# Altium project LimeSDR-X3_1v0.PrjPcb (part 19 of 19)
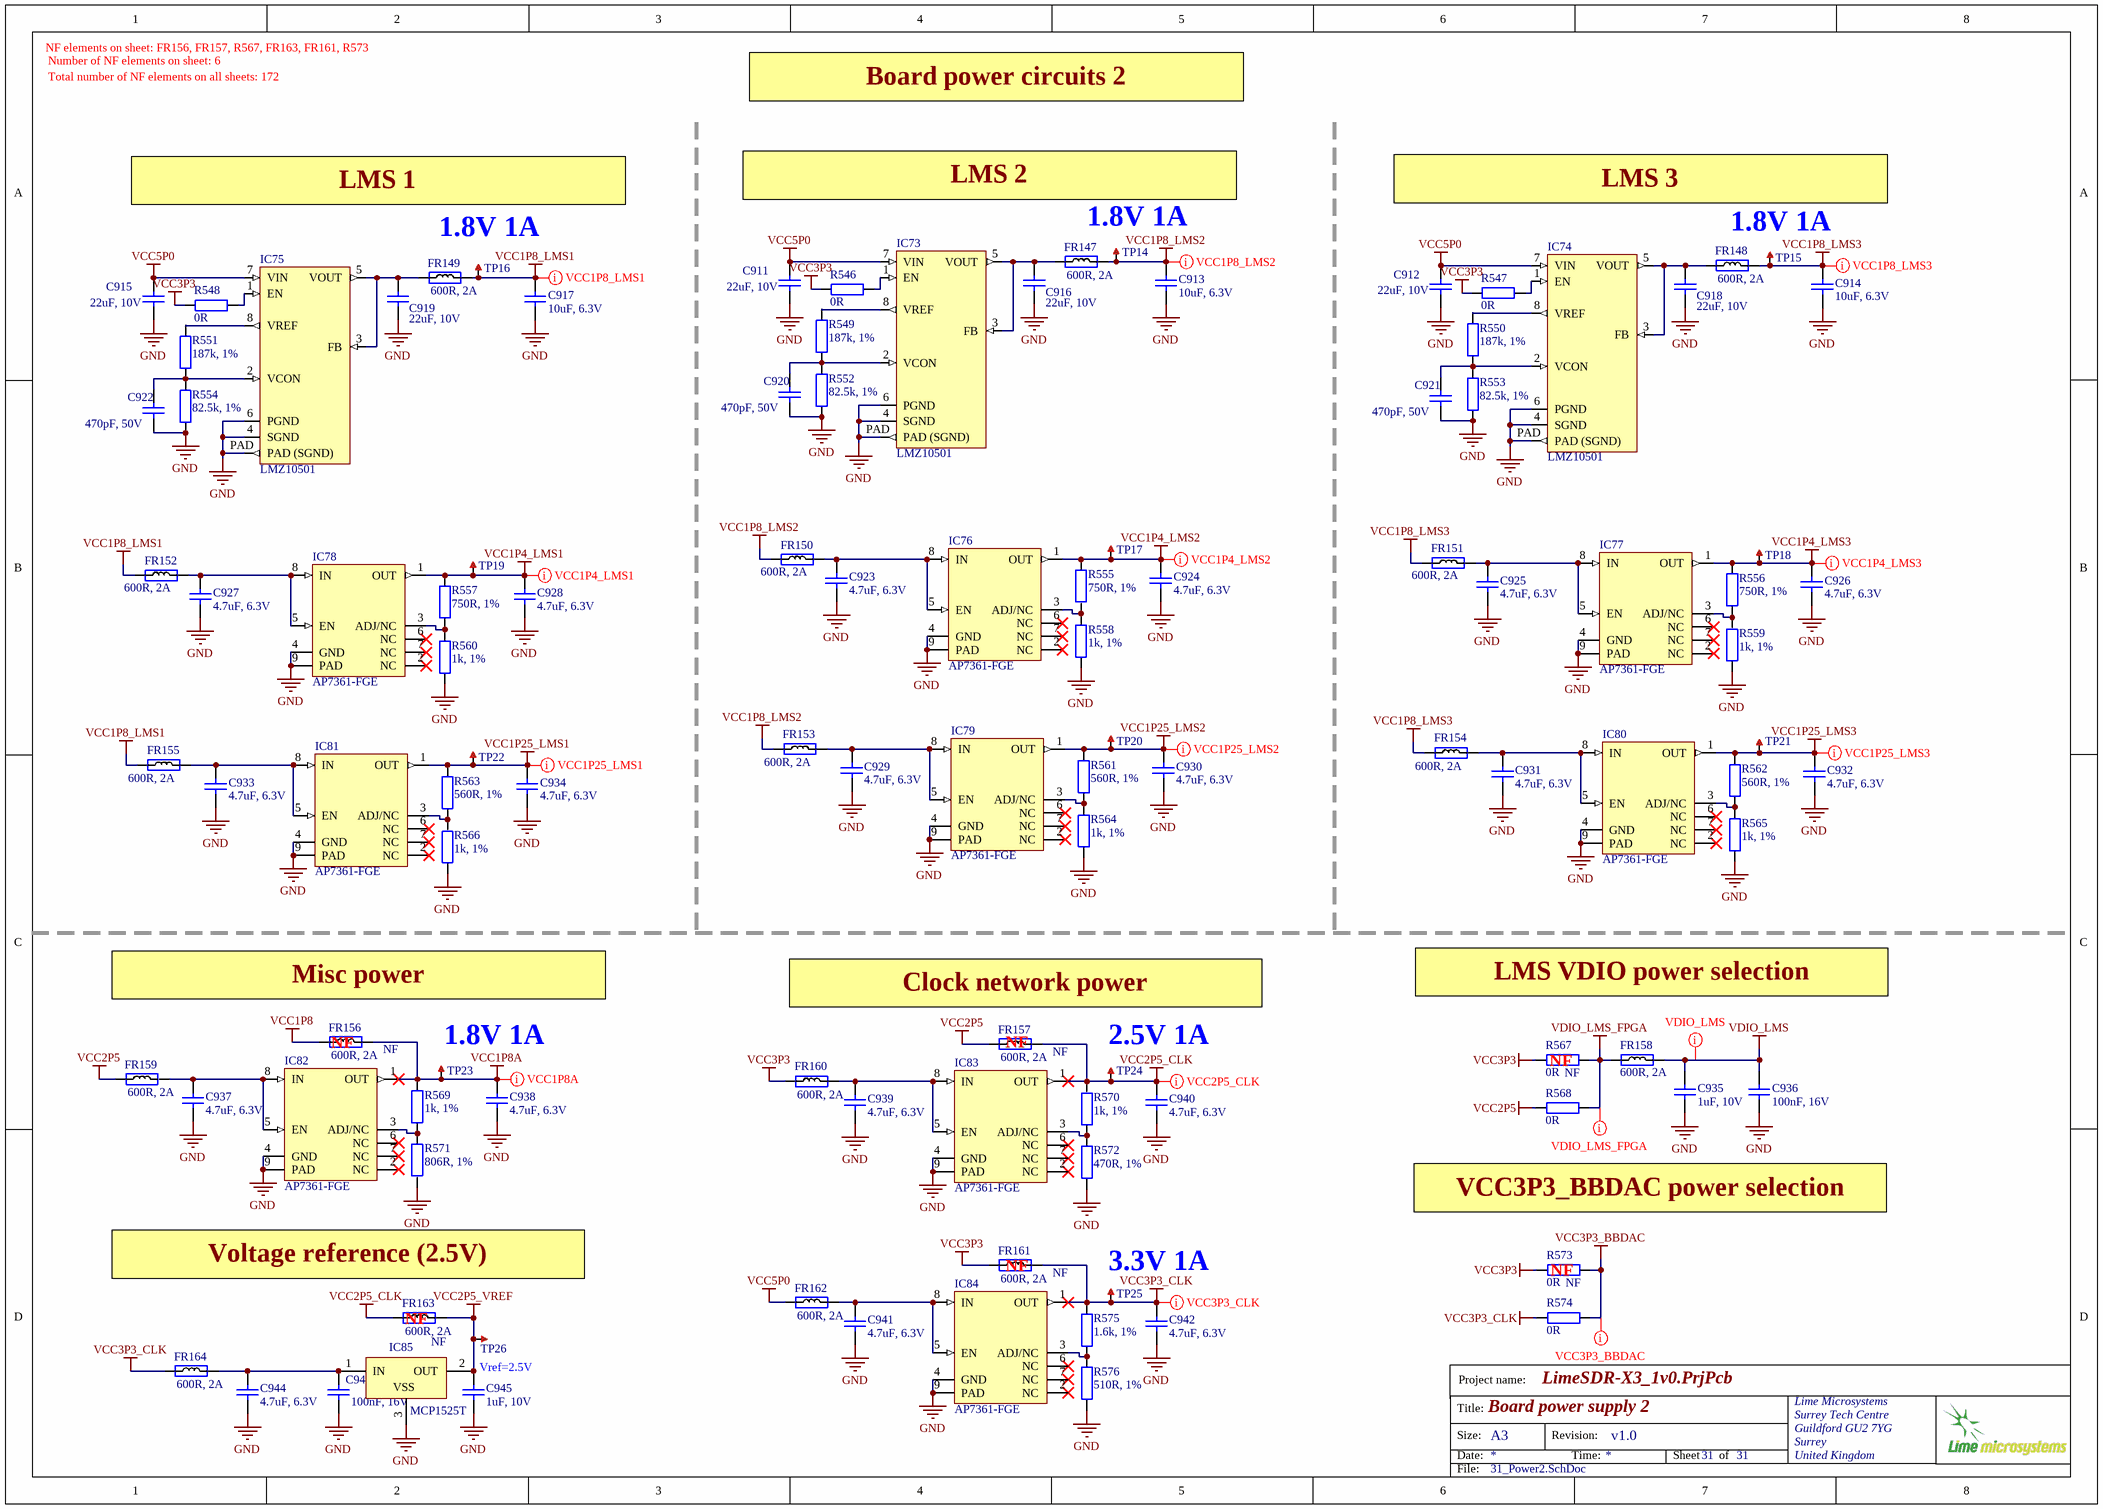
[diagram p31: 31_Power2.SchDoc]

## Nets that join several sheets
FPGA_MGTAVTT: 19_FPGA_misc (R156.2 R159.2), 20_FPGA_Power (26 pins)
GND: 05_LMS1_Misc (22 pins), 06_LMS2_Misc (51 pins), 07_LMS3_Misc (11 pins), 08_LMS1_RF (76 pins), 09_LMS2_RF (24 pins), 10_LMS3_RF (57 pins), 11_LMS1_Power (84 pins), 12_LMS2_Power (84 pins), 13_LMS3_Power (84 pins), 14_LMS1_RF_PA (72 pins), 15_LMS2_RF1_Misc (69 pins), 16_LMS2_RF2_Misc (69 pins), 17_FPGA_B12_B13_B14_B15 (IC35.L19 IC35.V24 IC35.W18 IC35.Y22), 19_FPGA_misc (53 pins), 20_FPGA_Power (244 pins), 21_Peripherals (52 pins), 22_LMS2_TX_BB_DACs (86 pins), 23_LMS2_RX1_BB_ADC (44 pins), 24_LMS2_RX2_BB_ADC (44 pins), 25_LMS3_RX1_BB_ADC (44 pins), 26_LMS3_RX2_BB_ADC (44 pins), 27_WR_PTP (73 pins), 28_Clocks1 (76 pins), 29_Clocks2 (76 pins), 30_Power1 (147 pins), 31_Power2 (75 pins)
GND_ADC: 19_FPGA_misc (IC35.N11 IC35.P11 IC35.P12), 20_FPGA_Power (C496.1 C497.2 FR103.2 IC35.M11)
VCC1P0: 20_FPGA_Power (12 pins), 30_Power1 (7 pins)
VCC1P0_INT: 20_FPGA_Power (30 pins), 30_Power1 (7 pins)
VCC1P2: 20_FPGA_Power (FR101.2), 30_Power1 (6 pins)
VCC1P4_LMS1: 11_LMS1_Power (7 pins), 31_Power2 (C928.2 IC78.1 R557.1 TP19.1)
VCC1P4_LMS2: 12_LMS2_Power (7 pins), 31_Power2 (C924.2 IC76.1 R555.1 TP17.1)
VCC1P4_LMS3: 13_LMS3_Power (7 pins), 31_Power2 (C926.2 IC77.1 R556.1 TP18.1)
VCC1P8: 20_FPGA_Power (14 pins), 29_Clocks2 (R477.2), 30_Power1 (6 pins), 31_Power2 (FR156.1)
VCC1P8_LMS1: 08_LMS1_RF (24 pins), 11_LMS1_Power (11 pins), 31_Power2 (5 pins)
VCC1P8_LMS2: 09_LMS2_RF (12 pins), 12_LMS2_Power (11 pins), 31_Power2 (5 pins)
VCC1P8_LMS3: 10_LMS3_RF (18 pins), 13_LMS3_Power (11 pins), 31_Power2 (5 pins)
VCC1P8A: 21_Peripherals (C512.1 IC43.6), 22_LMS2_TX_BB_DACs (8 pins), 23_LMS2_RX1_BB_ADC (FR116.1 FR117.1), 24_LMS2_RX2_BB_ADC (FR119.1 FR120.1), 25_LMS3_RX1_BB_ADC (FR122.1 FR123.1), 26_LMS3_RX2_BB_ADC (FR125.1 FR126.1), 29_Clocks2 (R476.1), 31_Power2 (5 pins)
VCC1P25_LMS1: 11_LMS1_Power (18 pins), 31_Power2 (C934.2 IC81.1 R563.2 TP22.1)
VCC1P25_LMS2: 12_LMS2_Power (18 pins), 31_Power2 (C930.2 IC79.1 R561.2 TP20.1)
VCC1P25_LMS3: 13_LMS3_Power (18 pins), 31_Power2 (C932.2 IC80.1 R562.2 TP21.1)
VCC2P5: 20_FPGA_Power (84 pins), 21_Peripherals (7 pins), 28_Clocks1 (R431.2), 30_Power1 (6 pins), 31_Power2 (FR157.1 FR159.1 R568.2)
VCC2P5_CLK: 27_WR_PTP (R394.2), 28_Clocks1 (R429.1 R460.2), 29_Clocks2 (26 pins), 31_Power2 (6 pins)
VCC2P5_VREF: 27_WR_PTP (R392.1), 28_Clocks1 (R456.1), 31_Power2 (C945.2 FR163.2 IC85.2 TP26.1)
VCC3P3: 19_FPGA_misc (18 pins), 20_FPGA_Power (20 pins), 21_Peripherals (17 pins), 23_LMS2_RX1_BB_ADC (R296.2), 24_LMS2_RX2_BB_ADC (R324.2), 25_LMS3_RX1_BB_ADC (R352.2), 26_LMS3_RX2_BB_ADC (R380.2), 27_WR_PTP (10 pins), 29_Clocks2 (C827.2 IC64.1), 30_Power1 (8 pins), 31_Power2 (7 pins)
VCC3P3_BBDAC: 22_LMS2_TX_BB_DACs (12 pins), 31_Power2 (R573.1 R574.1)
VCC3P3_CLK: 21_Peripherals (FR104.1), 28_Clocks1 (11 pins), 29_Clocks2 (6 pins), 31_Power2 (7 pins)
VCC3P3_RF: 08_LMS1_RF (8 pins), 10_LMS3_RF (C80.2 C81.2 IC11.12 IC12.12), 14_LMS1_RF_PA (R114.2 R126.2), 15_LMS2_RF1_Misc (8 pins), 16_LMS2_RF2_Misc (8 pins), 30_Power1 (C891.2 FR142.2)
VCC5P0: 21_Peripherals (R212.1 R217.2 R234.1), 23_LMS2_RX1_BB_ADC (R297.2), 24_LMS2_RX2_BB_ADC (R325.2), 25_LMS3_RX1_BB_ADC (R353.2), 26_LMS3_RX2_BB_ADC (R381.2), 29_Clocks2 (R481.1), 30_Power1 (9 pins), 31_Power2 (7 pins)
VCC5P0_RF1: 14_LMS1_RF_PA (8 pins), 15_LMS2_RF1_Misc (R139.1), 30_Power1 (C908.2 FR145.2)
VCC5P0_RF2: 16_LMS2_RF2_Misc (R150.1), 30_Power1 (C909.2 FR146.2)
VCC12P0: 21_Peripherals (R218.2), 30_Power1 (46 pins)
VCC12P0_PCIE: 19_FPGA_misc (10 pins), 30_Power1 (FUSE1.2)
VCC_LMS2_PA1: 15_LMS2_RF1_Misc (C313.2 IC23.1 R137.2), 30_Power1 (C900.2 FR143.2)
VCC_LMS2_PA2: 16_LMS2_RF2_Misc (C340.2 IC31.1 R148.2), 30_Power1 (C902.2 FR144.2)
VDIO_LMS: 05_LMS1_Misc (9 pins), 06_LMS2_Misc (9 pins), 07_LMS3_Misc (9 pins), 11_LMS1_Power (6 pins), 12_LMS2_Power (6 pins), 13_LMS3_Power (6 pins), 31_Power2 (C935.2 C936.1 FR158.2)
VDIO_LMS_FPGA: 20_FPGA_Power (14 pins), 31_Power2 (FR158.1 R567.1 R568.1)
ADF_MUXOUT: 17_FPGA_B12_B13_B14_B15 (IC35.M19), 28_Clocks1 (IC60.15 R447.1)
BOM_VER0: 18_FPGA_B16_B33_B34_B35 (IC35.K2), 19_FPGA_misc (R187.1)
BOM_VER1: 17_FPGA_B12_B13_B14_B15 (IC35.Y23), 19_FPGA_misc (R188.1)
BOM_VER2: 17_FPGA_B12_B13_B14_B15 (IC35.W24), 19_FPGA_misc (R189.1)
BOM_VER3: 18_FPGA_B16_B33_B34_B35 (IC35.N8), 19_FPGA_misc (R190.1)
CDCM_LMS2_BB_DAC1_REFC_N: 18_FPGA_B16_B33_B34_B35 (IC35.N2), 29_Clocks2 (IC63.15)
CDCM_LMS2_BB_DAC1_REFC_P: 18_FPGA_B16_B33_B34_B35 (IC35.N3), 29_Clocks2 (IC63.14)
CDCM_LMS2_BB_DAC2_REFC_N: 18_FPGA_B16_B33_B34_B35 (IC35.F5), 29_Clocks2 (IC63.16)
CDCM_LMS2_BB_DAC2_REFC_P: 18_FPGA_B16_B33_B34_B35 (IC35.G5), 29_Clocks2 (IC63.17)
CDCM_PRI_REF: 28_Clocks1 (IC58.8), 29_Clocks2 (IC63.8)
CDCM_RESET_N: 17_FPGA_B12_B13_B14_B15 (IC35.AC18), 29_Clocks2 (C802.2 IC63.44 R475.1)
CDCM_STATUS0: 17_FPGA_B12_B13_B14_B15 (IC35.AB16), 29_Clocks2 (IC63.46)
CDCM_STATUS1: 17_FPGA_B12_B13_B14_B15 (IC35.AC16), 29_Clocks2 (IC63.45)
CDCM_SYNCN: 17_FPGA_B12_B13_B14_B15 (IC35.AA15), 29_Clocks2 (IC63.42)
CLK100_FPGA_N: 17_FPGA_B12_B13_B14_B15 (IC35.V21), 29_Clocks2 (XO8.5)
CLK100_FPGA_P: 17_FPGA_B12_B13_B14_B15 (IC35.U21), 29_Clocks2 (XO8.4)
EXT_CLK_IN_N: 28_Clocks1 (R421.2 R424.2), 29_Clocks2 (J30.3)
EXT_CLK_IN_P: 28_Clocks1 (R417.2), 29_Clocks2 (J30.2 R480.2)
EXT_CLK_OUT: 28_Clocks1 (IC58.18), 29_Clocks2 (R488.2 R490.2)
EXT_PPS_IN: 17_FPGA_B12_B13_B14_B15 (IC35.N21), 29_Clocks2 (J30.5)
EXT_PPS_OUT: 17_FPGA_B12_B13_B14_B15 (IC35.T22), 29_Clocks2 (J31.5)
EXT_SYNC_IN: 17_FPGA_B12_B13_B14_B15 (IC35.P20), 29_Clocks2 (J30.6)
EXT_SYNC_OUT: 17_FPGA_B12_B13_B14_B15 (IC35.M25), 29_Clocks2 (J31.6)
FAN_CTRL: 18_FPGA_B16_B33_B34_B35 (IC35.U4), 21_Peripherals (R228.2 R229.1 VT2.G)
FPGA_CFG_CS: 17_FPGA_B12_B13_B14_B15 (IC35.P18), 19_FPGA_misc (IC36.1 IC37.7 R186.2)
FPGA_CFG_D00: 17_FPGA_B12_B13_B14_B15 (IC35.R14), 19_FPGA_misc (R178.2)
FPGA_CFG_D01: 17_FPGA_B12_B13_B14_B15 (IC35.R15), 19_FPGA_misc (R180.2)
FPGA_CFG_D02: 17_FPGA_B12_B13_B14_B15 (IC35.P14), 19_FPGA_misc (R182.2)
FPGA_CFG_D03: 17_FPGA_B12_B13_B14_B15 (IC35.N14), 19_FPGA_misc (R184.2)
FPGA_I2C_SCL: 17_FPGA_B12_B13_B14_B15 (IC35.N16), 21_Peripherals (5 pins)
FPGA_I2C_SDA: 17_FPGA_B12_B13_B14_B15 (IC35.N17), 21_Peripherals (5 pins)
FPGA_LED1_G: 17_FPGA_B12_B13_B14_B15 (IC35.T20), 21_Peripherals (R200.2)
FPGA_LED1_R: 17_FPGA_B12_B13_B14_B15 (IC35.U17), 21_Peripherals (R205.2)
FPGA_LED2_G: 17_FPGA_B12_B13_B14_B15 (IC35.U16), 21_Peripherals (R210.2)
FPGA_LED2_R: 17_FPGA_B12_B13_B14_B15 (IC35.V17), 21_Peripherals (R213.2)
FPGA_LED3_G: 17_FPGA_B12_B13_B14_B15 (IC35.U15), 21_Peripherals (R214.2)
FPGA_LED3_R: 17_FPGA_B12_B13_B14_B15 (IC35.V16), 21_Peripherals (R215.2)
FPGA_LED4_G: 17_FPGA_B12_B13_B14_B15 (IC35.U14), 21_Peripherals (R219.2)
FPGA_LED4_R: 17_FPGA_B12_B13_B14_B15 (IC35.V14), 21_Peripherals (R222.2)
FPGA_LMS2_BB_ADC1_RESET: 18_FPGA_B16_B33_B34_B35 (IC35.D23), 23_LMS2_RX1_BB_ADC (IC46.12)
FPGA_LMS2_BB_ADC2_RESET: 17_FPGA_B12_B13_B14_B15 (IC35.K23), 24_LMS2_RX2_BB_ADC (IC48.12)
FPGA_LMS2_BB_DAC1_CLK_N: 18_FPGA_B16_B33_B34_B35 (IC35.L2), 29_Clocks2 (R483.1)
FPGA_LMS2_BB_DAC1_CLK_P: 18_FPGA_B16_B33_B34_B35 (IC35.M2), 29_Clocks2 (R479.1)
FPGA_LMS2_BB_DAC2_CLK_N: 18_FPGA_B16_B33_B34_B35 (IC35.D5), 29_Clocks2 (R495.1)
FPGA_LMS2_BB_DAC2_CLK_P: 18_FPGA_B16_B33_B34_B35 (IC35.E5), 29_Clocks2 (R487.1)
FPGA_LMS3_BB_ADC1_RESET: 18_FPGA_B16_B33_B34_B35 (IC35.D24), 25_LMS3_RX1_BB_ADC (IC50.12)
FPGA_LMS3_BB_ADC2_RESET: 18_FPGA_B16_B33_B34_B35 (IC35.D20), 26_LMS3_RX2_BB_ADC (IC52.12)
FPGA_SPI0_LMS1_MISO: 05_LMS1_Misc (R8.2), 18_FPGA_B16_B33_B34_B35 (IC35.V8)
FPGA_SPI0_LMS1_SS: 05_LMS1_Misc (R9.2), 18_FPGA_B16_B33_B34_B35 (IC35.W8)
FPGA_SPI0_LMS2_MISO: 06_LMS2_Misc (R44.2), 18_FPGA_B16_B33_B34_B35 (IC35.AB4)
FPGA_SPI0_LMS2_SS: 06_LMS2_Misc (R45.2), 18_FPGA_B16_B33_B34_B35 (IC35.AA2)
FPGA_SPI0_LMS3_MISO: 07_LMS3_Misc (R67.2), 18_FPGA_B16_B33_B34_B35 (IC35.AD3)
FPGA_SPI0_LMS3_SS: 07_LMS3_Misc (R68.2), 18_FPGA_B16_B33_B34_B35 (IC35.AC2)
FPGA_SPI0_MOSI: 05_LMS1_Misc (R7.2), 06_LMS2_Misc (R43.2), 07_LMS3_Misc (R66.2), 18_FPGA_B16_B33_B34_B35 (IC35.Y5)
FPGA_SPI0_SCLK: 05_LMS1_Misc (R6.2), 06_LMS2_Misc (R41.2), 07_LMS3_Misc (R65.2), 18_FPGA_B16_B33_B34_B35 (IC35.Y6)
FPGA_SPI1_CDCM_SS: 17_FPGA_B12_B13_B14_B15 (IC35.AB22), 29_Clocks2 (IC63.4)
FPGA_SPI1_LMS2_BB_ADC1_SS: 18_FPGA_B16_B33_B34_B35 (IC35.C22), 23_LMS2_RX1_BB_ADC (IC46.15)
FPGA_SPI1_LMS2_BB_ADC2_SS: 17_FPGA_B12_B13_B14_B15 (IC35.K22), 24_LMS2_RX2_BB_ADC (IC48.15)
FPGA_SPI1_LMS3_BB_ADC1_SS: 18_FPGA_B16_B33_B34_B35 (IC35.F20), 25_LMS3_RX1_BB_ADC (IC50.15)
FPGA_SPI1_LMS3_BB_ADC2_SS: 18_FPGA_B16_B33_B34_B35 (IC35.E20), 26_LMS3_RX2_BB_ADC (IC52.15)
FPGA_SPI1_MISO: 17_FPGA_B12_B13_B14_B15 (IC35.L14), 29_Clocks2 (IC63.3)
FPGA_SPI1_MISO_BB_ADC: 18_FPGA_B16_B33_B34_B35 (IC35.E22), 21_Peripherals (IC43.3 R241.2)
FPGA_SPI1_MISO_BB_ADC_LS: 21_Peripherals (IC43.4 R240.2 R241.1), 23_LMS2_RX1_BB_ADC (IC46.64), 24_LMS2_RX2_BB_ADC (IC48.64), 25_LMS3_RX1_BB_ADC (IC50.64), 26_LMS3_RX2_BB_ADC (IC52.64)
FPGA_SPI1_MOSI: 17_FPGA_B12_B13_B14_B15 (IC35.M14), 23_LMS2_RX1_BB_ADC (IC46.14), 24_LMS2_RX2_BB_ADC (IC48.14), 25_LMS3_RX1_BB_ADC (IC50.14), 26_LMS3_RX2_BB_ADC (IC52.14), 29_Clocks2 (IC63.2)
FPGA_SPI1_SCLK: 17_FPGA_B12_B13_B14_B15 (IC35.M16), 23_LMS2_RX1_BB_ADC (IC46.13), 24_LMS2_RX2_BB_ADC (IC48.13), 25_LMS3_RX1_BB_ADC (IC50.13), 26_LMS3_RX2_BB_ADC (IC52.13), 29_Clocks2 (IC63.5)
FPGA_SPI2_ADF_SS: 18_FPGA_B16_B33_B34_B35 (IC35.J5), 28_Clocks1 (R452.1)
FPGA_SPI2_LMS1_TX1DAC_SS: 14_LMS1_RF_PA (R119.2), 17_FPGA_B12_B13_B14_B15 (IC35.AA17)
FPGA_SPI2_LMS1_TX2DAC_SS: 14_LMS1_RF_PA (R131.2), 17_FPGA_B12_B13_B14_B15 (IC35.AB17)
FPGA_SPI2_MOSI: 14_LMS1_RF_PA (R121.2 R133.2), 18_FPGA_B16_B33_B34_B35 (IC35.B2), 27_WR_PTP (R393.2 R410.2), 28_Clocks1 (R451.1 R458.2)
FPGA_SPI2_SCLK: 14_LMS1_RF_PA (R120.2 R132.2), 18_FPGA_B16_B33_B34_B35 (IC35.C2), 27_WR_PTP (R391.2 R409.2), 28_Clocks1 (R450.1 R457.2)
FPGA_SPI2_XO_20_DAC_SS: 18_FPGA_B16_B33_B34_B35 (IC35.N7), 27_WR_PTP (R407.2)
FPGA_SPI2_XO_25_DAC_SS: 18_FPGA_B16_B33_B34_B35 (IC35.N6), 27_WR_PTP (R390.2)
FPGA_SPI2_XO_DAC_SS: 18_FPGA_B16_B33_B34_B35 (IC35.J6), 28_Clocks1 (R455.2)
FPGA_SW0: 18_FPGA_B16_B33_B34_B35 (IC35.K5), 21_Peripherals (R198.2 SW1.2)
FPGA_SW1: 18_FPGA_B16_B33_B34_B35 (IC35.L5), 21_Peripherals (R197.2 SW1.4)
FPGA_SW2: 18_FPGA_B16_B33_B34_B35 (IC35.G1), 21_Peripherals (R196.2 SW1.6)
FPGA_SW3: 18_FPGA_B16_B33_B34_B35 (IC35.G2), 21_Peripherals (R195.2 SW1.8)
GNSS_TPULSE: 17_FPGA_B12_B13_B14_B15 (IC35.L20), 21_Peripherals (IC42.3)
GNSS_UART_RX: 17_FPGA_B12_B13_B14_B15 (IC35.L25), 21_Peripherals (IC42.21)
GNSS_UART_TX: 17_FPGA_B12_B13_B14_B15 (IC35.L24), 21_Peripherals (IC42.20)
LM75_OS: 17_FPGA_B12_B13_B14_B15 (IC35.U24), 21_Peripherals (IC38.3 R199.1 R228.1)
LMK1_CLK1: 17_FPGA_B12_B13_B14_B15 (IC35.W21), 28_Clocks1 (IC58.1)
LMK1_CLK2: 18_FPGA_B16_B33_B34_B35 (IC35.R3), 28_Clocks1 (IC58.3)
LMK1_SEL0: 17_FPGA_B12_B13_B14_B15 (IC35.K15), 28_Clocks1 (R420.1)
LMK2_CLK: 17_FPGA_B12_B13_B14_B15 (IC35.M21), 29_Clocks2 (IC64.3)
LMK2_CLKIN0: 28_Clocks1 (IC58.5), 29_Clocks2 (C787.2)
LMK2_CLKIN1: 18_FPGA_B16_B33_B34_B35 (IC35.P4), 29_Clocks2 (C791.2)
LMK2_SEL0: 17_FPGA_B12_B13_B14_B15 (IC35.H21), 29_Clocks2 (R470.1)
LMS1_DIQ1_D0: 05_LMS1_Misc (IC1.AG31), 18_FPGA_B16_B33_B34_B35 (IC35.V4)
LMS1_DIQ1_D1: 05_LMS1_Misc (IC1.AF30), 18_FPGA_B16_B33_B34_B35 (IC35.W5)
LMS1_DIQ1_D2: 05_LMS1_Misc (IC1.AF34), 18_FPGA_B16_B33_B34_B35 (IC35.AC6)
LMS1_DIQ1_D3: 05_LMS1_Misc (IC1.AE31), 18_FPGA_B16_B33_B34_B35 (IC35.AB6)
LMS1_DIQ1_D4: 05_LMS1_Misc (IC1.AD30), 18_FPGA_B16_B33_B34_B35 (IC35.W4)
LMS1_DIQ1_D5: 05_LMS1_Misc (IC1.AC29), 18_FPGA_B16_B33_B34_B35 (IC35.AA7)
LMS1_DIQ1_D6: 05_LMS1_Misc (IC1.AE33), 18_FPGA_B16_B33_B34_B35 (IC35.AA5)
LMS1_DIQ1_D7: 05_LMS1_Misc (IC1.AD32), 18_FPGA_B16_B33_B34_B35 (IC35.AB5)
LMS1_DIQ1_D8: 05_LMS1_Misc (IC1.AC31), 18_FPGA_B16_B33_B34_B35 (IC35.AE5)
LMS1_DIQ1_D9: 05_LMS1_Misc (IC1.AC33), 18_FPGA_B16_B33_B34_B35 (IC35.AD5)
LMS1_DIQ1_D10: 05_LMS1_Misc (IC1.AB30), 18_FPGA_B16_B33_B34_B35 (IC35.AC4)
LMS1_DIQ1_D11: 05_LMS1_Misc (IC1.AB32), 18_FPGA_B16_B33_B34_B35 (IC35.AF5)
LMS1_DIQ2_D0: 05_LMS1_Misc (IC1.H30), 18_FPGA_B16_B33_B34_B35 (IC35.V2)
LMS1_DIQ2_D1: 05_LMS1_Misc (IC1.J31), 18_FPGA_B16_B33_B34_B35 (IC35.V3)
LMS1_DIQ2_D2: 05_LMS1_Misc (IC1.K30), 18_FPGA_B16_B33_B34_B35 (IC35.W1)
LMS1_DIQ2_D3: 05_LMS1_Misc (IC1.K32), 18_FPGA_B16_B33_B34_B35 (IC35.Y1)
LMS1_DIQ2_D4: 05_LMS1_Misc (IC1.L31), 18_FPGA_B16_B33_B34_B35 (IC35.AF2)
LMS1_DIQ2_D5: 05_LMS1_Misc (IC1.K34), 18_FPGA_B16_B33_B34_B35 (IC35.Y3)
LMS1_DIQ2_D6: 05_LMS1_Misc (IC1.M30), 18_FPGA_B16_B33_B34_B35 (IC35.AB1)
LMS1_DIQ2_D7: 05_LMS1_Misc (IC1.M32), 18_FPGA_B16_B33_B34_B35 (IC35.Y2)
LMS1_DIQ2_D8: 05_LMS1_Misc (IC1.N31), 18_FPGA_B16_B33_B34_B35 (IC35.AC1)
LMS1_DIQ2_D9: 05_LMS1_Misc (IC1.N33), 18_FPGA_B16_B33_B34_B35 (IC35.W3)
LMS1_DIQ2_D10: 05_LMS1_Misc (IC1.P30), 18_FPGA_B16_B33_B34_B35 (IC35.AE1)
LMS1_DIQ2_D11: 05_LMS1_Misc (IC1.P32), 18_FPGA_B16_B33_B34_B35 (IC35.AD1)
LMS1_EN_IQSEL1: 05_LMS1_Misc (IC1.Y32), 18_FPGA_B16_B33_B34_B35 (IC35.AD4)
LMS1_EN_IQSEL2: 05_LMS1_Misc (IC1.R33), 18_FPGA_B16_B33_B34_B35 (IC35.AE2)
LMS1_FCLK1: 05_LMS1_Misc (IC1.AA33), 18_FPGA_B16_B33_B34_B35 (IC35.AB2)
LMS1_FCLK2: 05_LMS1_Misc (IC1.R29), 18_FPGA_B16_B33_B34_B35 (IC35.AC3)
LMS1_MCLK1: 05_LMS1_Misc (IC1.AB34), 18_FPGA_B16_B33_B34_B35 (IC35.AA3)
LMS1_MCLK2: 05_LMS1_Misc (IC1.P34), 18_FPGA_B16_B33_B34_B35 (IC35.AA4)
LMS1_RESET: 05_LMS1_Misc (IC1.E27 R2.1), 18_FPGA_B16_B33_B34_B35 (IC35.V1)
LMS1_RXEN: 05_LMS1_Misc (IC1.V34 R4.2), 18_FPGA_B16_B33_B34_B35 (IC35.AE3)
LMS1_RxPLL_CLK: 05_LMS1_Misc (IC1.AM24), 29_Clocks2 (C795.2 R465.1)
LMS1_TX1_EN: 14_LMS1_RF_PA (IC13.3), 17_FPGA_B12_B13_B14_B15 (IC35.J23)
LMS1_TX1_OUT: 08_LMS1_RF (C31.1), 14_LMS1_RF_PA (IC14.1)
LMS1_TX2_EN: 14_LMS1_RF_PA (IC16.3), 17_FPGA_B12_B13_B14_B15 (IC35.H23)
LMS1_TX2_OUT: 08_LMS1_RF (C37.1), 14_LMS1_RF_PA (IC17.1)
LMS1_TXEN: 05_LMS1_Misc (IC1.U29 R3.2), 18_FPGA_B16_B33_B34_B35 (IC35.V6)
LMS1_TXNRX1: 05_LMS1_Misc (IC1.V32 R1.1), 18_FPGA_B16_B33_B34_B35 (IC35.AF4)
LMS1_TXNRX2: 05_LMS1_Misc (IC1.U31 R10.2), 18_FPGA_B16_B33_B34_B35 (IC35.AF3)
LMS1_TxPLL_CLK: 05_LMS1_Misc (IC1.E5), 29_Clocks2 (C794.2 R464.1)
LMS2_BB_ADC1_CLK_N: 23_LMS2_RX1_BB_ADC (C578.2 R271.1), 29_Clocks2 (IC63.25)
LMS2_BB_ADC1_CLK_P: 23_LMS2_RX1_BB_ADC (C577.2 R271.2), 29_Clocks2 (IC63.26)
LMS2_BB_ADC1_CLKOUT_N: 18_FPGA_B16_B33_B34_B35 (IC35.C18), 23_LMS2_RX1_BB_ADC (IC46.56)
LMS2_BB_ADC1_CLKOUT_P: 18_FPGA_B16_B33_B34_B35 (IC35.D18), 23_LMS2_RX1_BB_ADC (IC46.57)
LMS2_BB_ADC1_DA0_N: 18_FPGA_B16_B33_B34_B35 (IC35.A20), 23_LMS2_RX1_BB_ADC (IC46.40)
LMS2_BB_ADC1_DA0_P: 18_FPGA_B16_B33_B34_B35 (IC35.B20), 23_LMS2_RX1_BB_ADC (IC46.41)
LMS2_BB_ADC1_DA1_N: 18_FPGA_B16_B33_B34_B35 (IC35.A18), 23_LMS2_RX1_BB_ADC (IC46.42)
LMS2_BB_ADC1_DA1_P: 18_FPGA_B16_B33_B34_B35 (IC35.A17), 23_LMS2_RX1_BB_ADC (IC46.43)
LMS2_BB_ADC1_DA2_N: 18_FPGA_B16_B33_B34_B35 (IC35.F17), 23_LMS2_RX1_BB_ADC (IC46.44)
LMS2_BB_ADC1_DA2_P: 18_FPGA_B16_B33_B34_B35 (IC35.G17), 23_LMS2_RX1_BB_ADC (IC46.45)
LMS2_BB_ADC1_DA3_N: 18_FPGA_B16_B33_B34_B35 (IC35.A19), 23_LMS2_RX1_BB_ADC (IC46.46)
LMS2_BB_ADC1_DA3_P: 18_FPGA_B16_B33_B34_B35 (IC35.B19), 23_LMS2_RX1_BB_ADC (IC46.47)
LMS2_BB_ADC1_DA4_N: 18_FPGA_B16_B33_B34_B35 (IC35.B17), 23_LMS2_RX1_BB_ADC (IC46.50)
LMS2_BB_ADC1_DA4_P: 18_FPGA_B16_B33_B34_B35 (IC35.C17), 23_LMS2_RX1_BB_ADC (IC46.51)
LMS2_BB_ADC1_DA5_N: 18_FPGA_B16_B33_B34_B35 (IC35.D16), 23_LMS2_RX1_BB_ADC (IC46.52)
LMS2_BB_ADC1_DA5_P: 18_FPGA_B16_B33_B34_B35 (IC35.E16), 23_LMS2_RX1_BB_ADC (IC46.53)
LMS2_BB_ADC1_DA6_N: 18_FPGA_B16_B33_B34_B35 (IC35.A22), 23_LMS2_RX1_BB_ADC (IC46.54)
LMS2_BB_ADC1_DA6_P: 18_FPGA_B16_B33_B34_B35 (IC35.B22), 23_LMS2_RX1_BB_ADC (IC46.55)
LMS2_BB_ADC1_DB0_N: 18_FPGA_B16_B33_B34_B35 (IC35.A24), 23_LMS2_RX1_BB_ADC (IC46.60)
LMS2_BB_ADC1_DB0_P: 18_FPGA_B16_B33_B34_B35 (IC35.A23), 23_LMS2_RX1_BB_ADC (IC46.61)
LMS2_BB_ADC1_DB1_N: 18_FPGA_B16_B33_B34_B35 (IC35.B26), 23_LMS2_RX1_BB_ADC (IC46.62)
LMS2_BB_ADC1_DB1_P: 18_FPGA_B16_B33_B34_B35 (IC35.C26), 23_LMS2_RX1_BB_ADC (IC46.63)
LMS2_BB_ADC1_DB2_N: 18_FPGA_B16_B33_B34_B35 (IC35.F19), 23_LMS2_RX1_BB_ADC (IC46.2)
LMS2_BB_ADC1_DB2_P: 18_FPGA_B16_B33_B34_B35 (IC35.F18), 23_LMS2_RX1_BB_ADC (IC46.3)
LMS2_BB_ADC1_DB3_N: 18_FPGA_B16_B33_B34_B35 (IC35.B21), 23_LMS2_RX1_BB_ADC (IC46.4)
LMS2_BB_ADC1_DB3_P: 18_FPGA_B16_B33_B34_B35 (IC35.C21), 23_LMS2_RX1_BB_ADC (IC46.5)
LMS2_BB_ADC1_DB4_N: 18_FPGA_B16_B33_B34_B35 (IC35.D21), 23_LMS2_RX1_BB_ADC (IC46.6)
LMS2_BB_ADC1_DB4_P: 18_FPGA_B16_B33_B34_B35 (IC35.E21), 23_LMS2_RX1_BB_ADC (IC46.7)
LMS2_BB_ADC1_DB5_N: 18_FPGA_B16_B33_B34_B35 (IC35.B24), 23_LMS2_RX1_BB_ADC (IC46.8)
LMS2_BB_ADC1_DB5_P: 18_FPGA_B16_B33_B34_B35 (IC35.C24), 23_LMS2_RX1_BB_ADC (IC46.9)
LMS2_BB_ADC1_DB6_N: 18_FPGA_B16_B33_B34_B35 (IC35.A25), 23_LMS2_RX1_BB_ADC (IC46.10)
LMS2_BB_ADC1_DB6_P: 18_FPGA_B16_B33_B34_B35 (IC35.B25), 23_LMS2_RX1_BB_ADC (IC46.11)
LMS2_BB_ADC2_CLK_N: 24_LMS2_RX2_BB_ADC (C608.2 R299.1), 29_Clocks2 (IC63.28)
LMS2_BB_ADC2_CLK_P: 24_LMS2_RX2_BB_ADC (C607.2 R299.2), 29_Clocks2 (IC63.29)
LMS2_BB_ADC2_CLKOUT_N: 17_FPGA_B12_B13_B14_B15 (IC35.J21), 24_LMS2_RX2_BB_ADC (IC48.56)
LMS2_BB_ADC2_CLKOUT_P: 17_FPGA_B12_B13_B14_B15 (IC35.K21), 24_LMS2_RX2_BB_ADC (IC48.57)
LMS2_BB_ADC2_DA0_N: 17_FPGA_B12_B13_B14_B15 (IC35.D25), 24_LMS2_RX2_BB_ADC (IC48.40)
LMS2_BB_ADC2_DA0_P: 17_FPGA_B12_B13_B14_B15 (IC35.E25), 24_LMS2_RX2_BB_ADC (IC48.41)
LMS2_BB_ADC2_DA1_N: 17_FPGA_B12_B13_B14_B15 (IC35.K17), 24_LMS2_RX2_BB_ADC (IC48.42)
LMS2_BB_ADC2_DA1_P: 17_FPGA_B12_B13_B14_B15 (IC35.K16), 24_LMS2_RX2_BB_ADC (IC48.43)
LMS2_BB_ADC2_DA2_N: 17_FPGA_B12_B13_B14_B15 (IC35.E23), 24_LMS2_RX2_BB_ADC (IC48.44)
LMS2_BB_ADC2_DA2_P: 17_FPGA_B12_B13_B14_B15 (IC35.F23), 24_LMS2_RX2_BB_ADC (IC48.45)
LMS2_BB_ADC2_DA3_N: 17_FPGA_B12_B13_B14_B15 (IC35.H19), 24_LMS2_RX2_BB_ADC (IC48.46)
LMS2_BB_ADC2_DA3_P: 17_FPGA_B12_B13_B14_B15 (IC35.J19), 24_LMS2_RX2_BB_ADC (IC48.47)
LMS2_BB_ADC2_DA4_N: 17_FPGA_B12_B13_B14_B15 (IC35.F24), 24_LMS2_RX2_BB_ADC (IC48.50)
LMS2_BB_ADC2_DA4_P: 17_FPGA_B12_B13_B14_B15 (IC35.G24), 24_LMS2_RX2_BB_ADC (IC48.51)
LMS2_BB_ADC2_DA5_N: 17_FPGA_B12_B13_B14_B15 (IC35.D26), 24_LMS2_RX2_BB_ADC (IC48.52)
LMS2_BB_ADC2_DA5_P: 17_FPGA_B12_B13_B14_B15 (IC35.E26), 24_LMS2_RX2_BB_ADC (IC48.53)
LMS2_BB_ADC2_DA6_N: 17_FPGA_B12_B13_B14_B15 (IC35.F25), 24_LMS2_RX2_BB_ADC (IC48.54)
LMS2_BB_ADC2_DA6_P: 17_FPGA_B12_B13_B14_B15 (IC35.G25), 24_LMS2_RX2_BB_ADC (IC48.55)
LMS2_BB_ADC2_DB0_N: 17_FPGA_B12_B13_B14_B15 (IC35.G26), 24_LMS2_RX2_BB_ADC (IC48.60)
LMS2_BB_ADC2_DB0_P: 17_FPGA_B12_B13_B14_B15 (IC35.H26), 24_LMS2_RX2_BB_ADC (IC48.61)
LMS2_BB_ADC2_DB1_N: 17_FPGA_B12_B13_B14_B15 (IC35.J26), 24_LMS2_RX2_BB_ADC (IC48.62)
LMS2_BB_ADC2_DB1_P: 17_FPGA_B12_B13_B14_B15 (IC35.J25), 24_LMS2_RX2_BB_ADC (IC48.63)
LMS2_BB_ADC2_DB2_N: 17_FPGA_B12_B13_B14_B15 (IC35.H24), 24_LMS2_RX2_BB_ADC (IC48.2)
LMS2_BB_ADC2_DB2_P: 17_FPGA_B12_B13_B14_B15 (IC35.J24), 24_LMS2_RX2_BB_ADC (IC48.3)
LMS2_BB_ADC2_DB3_N: 17_FPGA_B12_B13_B14_B15 (IC35.H18), 24_LMS2_RX2_BB_ADC (IC48.4)
LMS2_BB_ADC2_DB3_P: 17_FPGA_B12_B13_B14_B15 (IC35.J18), 24_LMS2_RX2_BB_ADC (IC48.5)
LMS2_BB_ADC2_DB4_N: 17_FPGA_B12_B13_B14_B15 (IC35.J20), 24_LMS2_RX2_BB_ADC (IC48.6)
LMS2_BB_ADC2_DB4_P: 17_FPGA_B12_B13_B14_B15 (IC35.K20), 24_LMS2_RX2_BB_ADC (IC48.7)
LMS2_BB_ADC2_DB5_N: 17_FPGA_B12_B13_B14_B15 (IC35.F22), 24_LMS2_RX2_BB_ADC (IC48.8)
LMS2_BB_ADC2_DB5_P: 17_FPGA_B12_B13_B14_B15 (IC35.G22), 24_LMS2_RX2_BB_ADC (IC48.9)
LMS2_BB_ADC2_DB6_N: 17_FPGA_B12_B13_B14_B15 (IC35.L18), 24_LMS2_RX2_BB_ADC (IC48.10)
LMS2_BB_ADC2_DB6_P: 17_FPGA_B12_B13_B14_B15 (IC35.L17), 24_LMS2_RX2_BB_ADC (IC48.11)
LMS2_BB_DAC1_B0_N: 18_FPGA_B16_B33_B34_B35 (IC35.M1), 22_LMS2_TX_BB_DACs (IC44.9)
LMS2_BB_DAC1_B0_P: 18_FPGA_B16_B33_B34_B35 (IC35.N1), 22_LMS2_TX_BB_DACs (IC44.8)
LMS2_BB_DAC1_B1_N: 18_FPGA_B16_B33_B34_B35 (IC35.R6), 22_LMS2_TX_BB_DACs (IC44.7)
LMS2_BB_DAC1_B1_P: 18_FPGA_B16_B33_B34_B35 (IC35.R7), 22_LMS2_TX_BB_DACs (IC44.6)
LMS2_BB_DAC1_B2_N: 18_FPGA_B16_B33_B34_B35 (IC35.L7), 22_LMS2_TX_BB_DACs (IC44.5)
LMS2_BB_DAC1_B2_P: 18_FPGA_B16_B33_B34_B35 (IC35.M7), 22_LMS2_TX_BB_DACs (IC44.4)
LMS2_BB_DAC1_B3_N: 18_FPGA_B16_B33_B34_B35 (IC35.T7), 22_LMS2_TX_BB_DACs (IC44.3)
LMS2_BB_DAC1_B3_P: 18_FPGA_B16_B33_B34_B35 (IC35.T8), 22_LMS2_TX_BB_DACs (IC44.2)
LMS2_BB_DAC1_B4_N: 18_FPGA_B16_B33_B34_B35 (IC35.P8), 22_LMS2_TX_BB_DACs (IC44.1)
LMS2_BB_DAC1_B4_P: 18_FPGA_B16_B33_B34_B35 (IC35.R8), 22_LMS2_TX_BB_DACs (IC44.68)
LMS2_BB_DAC1_B5_N: 18_FPGA_B16_B33_B34_B35 (IC35.U5), 22_LMS2_TX_BB_DACs (IC44.67)
LMS2_BB_DAC1_B5_P: 18_FPGA_B16_B33_B34_B35 (IC35.U6), 22_LMS2_TX_BB_DACs (IC44.66)
LMS2_BB_DAC1_B6_N: 18_FPGA_B16_B33_B34_B35 (IC35.P5), 22_LMS2_TX_BB_DACs (IC44.65)
LMS2_BB_DAC1_B6_P: 18_FPGA_B16_B33_B34_B35 (IC35.P6), 22_LMS2_TX_BB_DACs (IC44.64)
LMS2_BB_DAC1_B7_N: 18_FPGA_B16_B33_B34_B35 (IC35.R5), 22_LMS2_TX_BB_DACs (IC44.63)
LMS2_BB_DAC1_B7_P: 18_FPGA_B16_B33_B34_B35 (IC35.T5), 22_LMS2_TX_BB_DACs (IC44.62)
LMS2_BB_DAC1_B8_N: 18_FPGA_B16_B33_B34_B35 (IC35.U1), 22_LMS2_TX_BB_DACs (IC44.60)
LMS2_BB_DAC1_B8_P: 18_FPGA_B16_B33_B34_B35 (IC35.U2), 22_LMS2_TX_BB_DACs (IC44.59)
LMS2_BB_DAC1_B9_N: 18_FPGA_B16_B33_B34_B35 (IC35.R2), 22_LMS2_TX_BB_DACs (IC44.58)
LMS2_BB_DAC1_B9_P: 18_FPGA_B16_B33_B34_B35 (IC35.T2), 22_LMS2_TX_BB_DACs (IC44.57)
LMS2_BB_DAC1_B10_N: 18_FPGA_B16_B33_B34_B35 (IC35.P1), 22_LMS2_TX_BB_DACs (IC44.56)
LMS2_BB_DAC1_B10_P: 18_FPGA_B16_B33_B34_B35 (IC35.R1), 22_LMS2_TX_BB_DACs (IC44.55)
LMS2_BB_DAC1_B11_N: 18_FPGA_B16_B33_B34_B35 (IC35.T3), 22_LMS2_TX_BB_DACs (IC44.54)
LMS2_BB_DAC1_B11_P: 18_FPGA_B16_B33_B34_B35 (IC35.T4), 22_LMS2_TX_BB_DACs (IC44.53)
LMS2_BB_DAC1_B12_N: 18_FPGA_B16_B33_B34_B35 (IC35.L4), 22_LMS2_TX_BB_DACs (IC44.52)
LMS2_BB_DAC1_B12_P: 18_FPGA_B16_B33_B34_B35 (IC35.M4), 22_LMS2_TX_BB_DACs (IC44.51)
LMS2_BB_DAC1_B13_N: 18_FPGA_B16_B33_B34_B35 (IC35.J3), 22_LMS2_TX_BB_DACs (IC44.50)
LMS2_BB_DAC1_B13_P: 18_FPGA_B16_B33_B34_B35 (IC35.K3), 22_LMS2_TX_BB_DACs (IC44.49)
LMS2_BB_DAC1_B14_N: 18_FPGA_B16_B33_B34_B35 (IC35.J1), 22_LMS2_TX_BB_DACs (IC44.48)
LMS2_BB_DAC1_B14_P: 18_FPGA_B16_B33_B34_B35 (IC35.K1), 22_LMS2_TX_BB_DACs (IC44.47)
LMS2_BB_DAC1_B15_N: 18_FPGA_B16_B33_B34_B35 (IC35.H1), 22_LMS2_TX_BB_DACs (IC44.46)
LMS2_BB_DAC1_B15_P: 18_FPGA_B16_B33_B34_B35 (IC35.H2), 22_LMS2_TX_BB_DACs (IC44.45)
LMS2_BB_DAC1_CLK_N: 22_LMS2_TX_BB_DACs (C522.2), 29_Clocks2 (R483.2 R484.2)
LMS2_BB_DAC1_CLK_P: 22_LMS2_TX_BB_DACs (C524.2), 29_Clocks2 (R479.2 R482.2)
LMS2_BB_DAC1_PD: 17_FPGA_B12_B13_B14_B15 (IC35.M26), 22_LMS2_TX_BB_DACs (IC44.40)
LMS2_BB_DAC1_SELIQ_N: 18_FPGA_B16_B33_B34_B35 (IC35.M5), 22_LMS2_TX_BB_DACs (IC44.44)
LMS2_BB_DAC1_SELIQ_P: 18_FPGA_B16_B33_B34_B35 (IC35.M6), 22_LMS2_TX_BB_DACs (IC44.43)
LMS2_BB_DAC2_B0_N: 18_FPGA_B16_B33_B34_B35 (IC35.D6), 22_LMS2_TX_BB_DACs (IC45.9)
LMS2_BB_DAC2_B0_P: 18_FPGA_B16_B33_B34_B35 (IC35.E6), 22_LMS2_TX_BB_DACs (IC45.8)
LMS2_BB_DAC2_B1_N: 18_FPGA_B16_B33_B34_B35 (IC35.G7), 22_LMS2_TX_BB_DACs (IC45.7)
LMS2_BB_DAC2_B1_P: 18_FPGA_B16_B33_B34_B35 (IC35.H7), 22_LMS2_TX_BB_DACs (IC45.6)
LMS2_BB_DAC2_B2_N: 18_FPGA_B16_B33_B34_B35 (IC35.E3), 22_LMS2_TX_BB_DACs (IC45.5)
LMS2_BB_DAC2_B2_P: 18_FPGA_B16_B33_B34_B35 (IC35.F3), 22_LMS2_TX_BB_DACs (IC45.4)
LMS2_BB_DAC2_B3_N: 18_FPGA_B16_B33_B34_B35 (IC35.K6), 22_LMS2_TX_BB_DACs (IC45.3)
LMS2_BB_DAC2_B3_P: 18_FPGA_B16_B33_B34_B35 (IC35.K7), 22_LMS2_TX_BB_DACs (IC45.2)
LMS2_BB_DAC2_B4_N: 18_FPGA_B16_B33_B34_B35 (IC35.H4), 22_LMS2_TX_BB_DACs (IC45.1)
LMS2_BB_DAC2_B4_P: 18_FPGA_B16_B33_B34_B35 (IC35.J4), 22_LMS2_TX_BB_DACs (IC45.68)
LMS2_BB_DAC2_B5_N: 18_FPGA_B16_B33_B34_B35 (IC35.E2), 22_LMS2_TX_BB_DACs (IC45.67)
LMS2_BB_DAC2_B5_P: 18_FPGA_B16_B33_B34_B35 (IC35.F2), 22_LMS2_TX_BB_DACs (IC45.66)
LMS2_BB_DAC2_B6_N: 18_FPGA_B16_B33_B34_B35 (IC35.D1), 22_LMS2_TX_BB_DACs (IC45.65)
LMS2_BB_DAC2_B6_P: 18_FPGA_B16_B33_B34_B35 (IC35.E1), 22_LMS2_TX_BB_DACs (IC45.64)
LMS2_BB_DAC2_B7_N: 18_FPGA_B16_B33_B34_B35 (IC35.B1), 22_LMS2_TX_BB_DACs (IC45.63)
LMS2_BB_DAC2_B7_P: 18_FPGA_B16_B33_B34_B35 (IC35.C1), 22_LMS2_TX_BB_DACs (IC45.62)
LMS2_BB_DAC2_B8_N: 18_FPGA_B16_B33_B34_B35 (IC35.C3), 22_LMS2_TX_BB_DACs (IC45.60)
LMS2_BB_DAC2_B8_P: 18_FPGA_B16_B33_B34_B35 (IC35.D3), 22_LMS2_TX_BB_DACs (IC45.59)
LMS2_BB_DAC2_B9_N: 18_FPGA_B16_B33_B34_B35 (IC35.A4), 22_LMS2_TX_BB_DACs (IC45.58)
LMS2_BB_DAC2_B9_P: 18_FPGA_B16_B33_B34_B35 (IC35.B4), 22_LMS2_TX_BB_DACs (IC45.57)
LMS2_BB_DAC2_B10_N: 18_FPGA_B16_B33_B34_B35 (IC35.A2), 22_LMS2_TX_BB_DACs (IC45.56)
LMS2_BB_DAC2_B10_P: 18_FPGA_B16_B33_B34_B35 (IC35.A3), 22_LMS2_TX_BB_DACs (IC45.55)
LMS2_BB_DAC2_B11_N: 18_FPGA_B16_B33_B34_B35 (IC35.A5), 22_LMS2_TX_BB_DACs (IC45.54)
LMS2_BB_DAC2_B11_P: 18_FPGA_B16_B33_B34_B35 (IC35.B5), 22_LMS2_TX_BB_DACs (IC45.53)
LMS2_BB_DAC2_B12_N: 18_FPGA_B16_B33_B34_B35 (IC35.G6), 22_LMS2_TX_BB_DACs (IC45.52)
LMS2_BB_DAC2_B12_P: 18_FPGA_B16_B33_B34_B35 (IC35.H6), 22_LMS2_TX_BB_DACs (IC45.51)
LMS2_BB_DAC2_B13_N: 18_FPGA_B16_B33_B34_B35 (IC35.F7), 22_LMS2_TX_BB_DACs (IC45.50)
LMS2_BB_DAC2_B13_P: 18_FPGA_B16_B33_B34_B35 (IC35.F8), 22_LMS2_TX_BB_DACs (IC45.49)
LMS2_BB_DAC2_B14_N: 18_FPGA_B16_B33_B34_B35 (IC35.G9), 22_LMS2_TX_BB_DACs (IC45.48)
LMS2_BB_DAC2_B14_P: 18_FPGA_B16_B33_B34_B35 (IC35.H9), 22_LMS2_TX_BB_DACs (IC45.47)
LMS2_BB_DAC2_B15_N: 18_FPGA_B16_B33_B34_B35 (IC35.G8), 22_LMS2_TX_BB_DACs (IC45.46)
LMS2_BB_DAC2_B15_P: 18_FPGA_B16_B33_B34_B35 (IC35.H8), 22_LMS2_TX_BB_DACs (IC45.45)
LMS2_BB_DAC2_CLK_N: 22_LMS2_TX_BB_DACs (C523.2), 29_Clocks2 (R495.2 R496.2)
LMS2_BB_DAC2_CLK_P: 22_LMS2_TX_BB_DACs (C525.2), 29_Clocks2 (R487.2 R491.2)
LMS2_BB_DAC2_PD: 17_FPGA_B12_B13_B14_B15 (IC35.N24), 22_LMS2_TX_BB_DACs (IC45.40)
LMS2_BB_DAC2_SELIQ_N: 18_FPGA_B16_B33_B34_B35 (IC35.K8), 22_LMS2_TX_BB_DACs (IC45.44)
LMS2_BB_DAC2_SELIQ_P: 18_FPGA_B16_B33_B34_B35 (IC35.L8), 22_LMS2_TX_BB_DACs (IC45.43)
LMS2_RESET: 06_LMS2_Misc (IC3.E27 R27.1), 18_FPGA_B16_B33_B34_B35 (IC35.V7)
LMS2_RX1_BB_I_N: 06_LMS2_Misc (FL10.3), 23_LMS2_RX1_BB_ADC (R270.2 R273.2)
LMS2_RX1_BB_I_P: 06_LMS2_Misc (FL9.3), 23_LMS2_RX1_BB_ADC (R273.1 R276.2)
LMS2_RX1_BB_Q_N: 06_LMS2_Misc (FL12.3), 23_LMS2_RX1_BB_ADC (R281.2 R283.2)
LMS2_RX1_BB_Q_P: 06_LMS2_Misc (FL11.3), 23_LMS2_RX1_BB_ADC (R283.1 R286.2)
LMS2_RX1_H: 09_LMS2_RF (C53.1), 15_LMS2_RF1_Misc (IC24.5)
LMS2_RX1_LNA_SD: 15_LMS2_RF1_Misc (IC25.6 R142.2), 17_FPGA_B12_B13_B14_B15 (IC35.AD23)
LMS2_RX2_BB_I_N: 06_LMS2_Misc (FL14.3), 24_LMS2_RX2_BB_ADC (R298.2 R301.2)
LMS2_RX2_BB_I_P: 06_LMS2_Misc (FL13.3), 24_LMS2_RX2_BB_ADC (R301.1 R304.2)
LMS2_RX2_BB_Q_N: 06_LMS2_Misc (FL16.3), 24_LMS2_RX2_BB_ADC (R309.2 R311.2)
LMS2_RX2_BB_Q_P: 06_LMS2_Misc (FL15.3), 24_LMS2_RX2_BB_ADC (R311.1 R314.2)
LMS2_RX2_H: 09_LMS2_RF (C54.1), 16_LMS2_RF2_Misc (IC32.5)
LMS2_RX2_LNA_SD: 16_LMS2_RF2_Misc (IC33.6 R153.2), 17_FPGA_B12_B13_B14_B15 (IC35.AD24)
LMS2_RXEN: 06_LMS2_Misc (IC3.V34 R31.2), 18_FPGA_B16_B33_B34_B35 (IC35.Y8)
LMS2_RxPLL_CLK: 06_LMS2_Misc (IC3.AM24), 29_Clocks2 (C797.2 R468.1)
LMS2_TX1_1: 09_LMS2_RF (C52.1), 15_LMS2_RF1_Misc (IC21.1)
LMS2_TX1_1_CPL_OUT: 10_LMS3_RF (C76.2), 15_LMS2_RF1_Misc (IC22.2)
LMS2_TX1_1_EN: 15_LMS2_RF1_Misc (IC23.3), 17_FPGA_B12_B13_B14_B15 (IC35.L15)
LMS2_TX1_BB_I_N: 06_LMS2_Misc (FL2.1), 22_LMS2_TX_BB_DACs (R256.2)
LMS2_TX1_BB_I_P: 06_LMS2_Misc (FL1.1), 22_LMS2_TX_BB_DACs (R264.2)
LMS2_TX1_BB_Q_N: 06_LMS2_Misc (FL4.1), 22_LMS2_TX_BB_DACs (R246.2)
LMS2_TX1_BB_Q_P: 06_LMS2_Misc (FL3.1), 22_LMS2_TX_BB_DACs (R254.2)
LMS2_TX2_1: 09_LMS2_RF (C51.1), 16_LMS2_RF2_Misc (IC29.1)
LMS2_TX2_1_CPL_OUT: 10_LMS3_RF (C77.2), 16_LMS2_RF2_Misc (IC30.2)
LMS2_TX2_1_EN: 16_LMS2_RF2_Misc (IC31.3), 18_FPGA_B16_B33_B34_B35 (IC35.H14)
LMS2_TX2_BB_I_N: 06_LMS2_Misc (FL6.1), 22_LMS2_TX_BB_DACs (R257.2)
LMS2_TX2_BB_I_P: 06_LMS2_Misc (FL5.1), 22_LMS2_TX_BB_DACs (R265.2)
LMS2_TX2_BB_Q_N: 06_LMS2_Misc (FL8.1), 22_LMS2_TX_BB_DACs (R247.2)
LMS2_TX2_BB_Q_P: 06_LMS2_Misc (FL7.1), 22_LMS2_TX_BB_DACs (R255.2)
LMS2_TXEN: 06_LMS2_Misc (IC3.U29 R29.2), 18_FPGA_B16_B33_B34_B35 (IC35.AA8)
LMS2_TxPLL_CLK: 06_LMS2_Misc (IC3.E5), 29_Clocks2 (C796.2 R466.1)
LMS3_BB_ADC1_CLK_N: 25_LMS3_RX1_BB_ADC (C638.2 R327.1), 29_Clocks2 (IC63.33)
LMS3_BB_ADC1_CLK_P: 25_LMS3_RX1_BB_ADC (C637.2 R327.2), 29_Clocks2 (IC63.32)
LMS3_BB_ADC1_CLKOUT_N: 17_FPGA_B12_B13_B14_B15 (IC35.AB20), 25_LMS3_RX1_BB_ADC (IC50.56)
LMS3_BB_ADC1_CLKOUT_P: 17_FPGA_B12_B13_B14_B15 (IC35.AA20), 25_LMS3_RX1_BB_ADC (IC50.57)
LMS3_BB_ADC1_DA0_N: 17_FPGA_B12_B13_B14_B15 (IC35.AD26), 25_LMS3_RX1_BB_ADC (IC50.40)
LMS3_BB_ADC1_DA0_P: 17_FPGA_B12_B13_B14_B15 (IC35.AD25), 25_LMS3_RX1_BB_ADC (IC50.41)
LMS3_BB_ADC1_DA1_N: 17_FPGA_B12_B13_B14_B15 (IC35.AC23), 25_LMS3_RX1_BB_ADC (IC50.42)
LMS3_BB_ADC1_DA1_P: 17_FPGA_B12_B13_B14_B15 (IC35.AC22), 25_LMS3_RX1_BB_ADC (IC50.43)
LMS3_BB_ADC1_DA2_N: 17_FPGA_B12_B13_B14_B15 (IC35.AE26), 25_LMS3_RX1_BB_ADC (IC50.44)
LMS3_BB_ADC1_DA2_P: 17_FPGA_B12_B13_B14_B15 (IC35.AE25), 25_LMS3_RX1_BB_ADC (IC50.45)
LMS3_BB_ADC1_DA3_N: 17_FPGA_B12_B13_B14_B15 (IC35.AF25), 25_LMS3_RX1_BB_ADC (IC50.46)
LMS3_BB_ADC1_DA3_P: 17_FPGA_B12_B13_B14_B15 (IC35.AF24), 25_LMS3_RX1_BB_ADC (IC50.47)
LMS3_BB_ADC1_DA4_N: 17_FPGA_B12_B13_B14_B15 (IC35.AF20), 25_LMS3_RX1_BB_ADC (IC50.50)
LMS3_BB_ADC1_DA4_P: 17_FPGA_B12_B13_B14_B15 (IC35.AF19), 25_LMS3_RX1_BB_ADC (IC50.51)
LMS3_BB_ADC1_DA5_N: 17_FPGA_B12_B13_B14_B15 (IC35.AF18), 25_LMS3_RX1_BB_ADC (IC50.52)
LMS3_BB_ADC1_DA5_P: 17_FPGA_B12_B13_B14_B15 (IC35.AE18), 25_LMS3_RX1_BB_ADC (IC50.53)
LMS3_BB_ADC1_DA6_N: 17_FPGA_B12_B13_B14_B15 (IC35.AF17), 25_LMS3_RX1_BB_ADC (IC50.54)
LMS3_BB_ADC1_DA6_P: 17_FPGA_B12_B13_B14_B15 (IC35.AE17), 25_LMS3_RX1_BB_ADC (IC50.55)
LMS3_BB_ADC1_DB0_N: 17_FPGA_B12_B13_B14_B15 (IC35.AD17), 25_LMS3_RX1_BB_ADC (IC50.60)
LMS3_BB_ADC1_DB0_P: 17_FPGA_B12_B13_B14_B15 (IC35.AC17), 25_LMS3_RX1_BB_ADC (IC50.61)
LMS3_BB_ADC1_DB1_N: 17_FPGA_B12_B13_B14_B15 (IC35.Y17), 25_LMS3_RX1_BB_ADC (IC50.62)
LMS3_BB_ADC1_DB1_P: 17_FPGA_B12_B13_B14_B15 (IC35.Y16), 25_LMS3_RX1_BB_ADC (IC50.63)
LMS3_BB_ADC1_DB2_N: 17_FPGA_B12_B13_B14_B15 (IC35.AA18), 25_LMS3_RX1_BB_ADC (IC50.2)
LMS3_BB_ADC1_DB2_P: 17_FPGA_B12_B13_B14_B15 (IC35.Y18), 25_LMS3_RX1_BB_ADC (IC50.3)
LMS3_BB_ADC1_DB3_N: 17_FPGA_B12_B13_B14_B15 (IC35.AE20), 25_LMS3_RX1_BB_ADC (IC50.4)
LMS3_BB_ADC1_DB3_P: 17_FPGA_B12_B13_B14_B15 (IC35.AD20), 25_LMS3_RX1_BB_ADC (IC50.5)
LMS3_BB_ADC1_DB4_N: 17_FPGA_B12_B13_B14_B15 (IC35.AE21), 25_LMS3_RX1_BB_ADC (IC50.6)
LMS3_BB_ADC1_DB4_P: 17_FPGA_B12_B13_B14_B15 (IC35.AD21), 25_LMS3_RX1_BB_ADC (IC50.7)
LMS3_BB_ADC1_DB5_N: 17_FPGA_B12_B13_B14_B15 (IC35.AF22), 25_LMS3_RX1_BB_ADC (IC50.8)
LMS3_BB_ADC1_DB5_P: 17_FPGA_B12_B13_B14_B15 (IC35.AE22), 25_LMS3_RX1_BB_ADC (IC50.9)
LMS3_BB_ADC1_DB6_N: 17_FPGA_B12_B13_B14_B15 (IC35.AF23), 25_LMS3_RX1_BB_ADC (IC50.10)
LMS3_BB_ADC1_DB6_P: 17_FPGA_B12_B13_B14_B15 (IC35.AE23), 25_LMS3_RX1_BB_ADC (IC50.11)
LMS3_BB_ADC2_CLK_N: 26_LMS3_RX2_BB_ADC (C668.2 R355.1), 29_Clocks2 (IC63.36)
LMS3_BB_ADC2_CLK_P: 26_LMS3_RX2_BB_ADC (C667.2 R355.2), 29_Clocks2 (IC63.35)
LMS3_BB_ADC2_CLKOUT_N: 17_FPGA_B12_B13_B14_B15 (IC35.V22), 26_LMS3_RX2_BB_ADC (IC52.56)
LMS3_BB_ADC2_CLKOUT_P: 17_FPGA_B12_B13_B14_B15 (IC35.U22), 26_LMS3_RX2_BB_ADC (IC52.57)
LMS3_BB_ADC2_DA0_N: 17_FPGA_B12_B13_B14_B15 (IC35.T15), 26_LMS3_RX2_BB_ADC (IC52.40)
LMS3_BB_ADC2_DA0_P: 17_FPGA_B12_B13_B14_B15 (IC35.T14), 26_LMS3_RX2_BB_ADC (IC52.41)
LMS3_BB_ADC2_DA1_N: 17_FPGA_B12_B13_B14_B15 (IC35.T18), 26_LMS3_RX2_BB_ADC (IC52.42)
LMS3_BB_ADC2_DA1_P: 17_FPGA_B12_B13_B14_B15 (IC35.T17), 26_LMS3_RX2_BB_ADC (IC52.43)
LMS3_BB_ADC2_DA2_N: 17_FPGA_B12_B13_B14_B15 (IC35.W23), 26_LMS3_RX2_BB_ADC (IC52.44)
LMS3_BB_ADC2_DA2_P: 17_FPGA_B12_B13_B14_B15 (IC35.V23), 26_LMS3_RX2_BB_ADC (IC52.45)
LMS3_BB_ADC2_DA3_N: 17_FPGA_B12_B13_B14_B15 (IC35.U19), 26_LMS3_RX2_BB_ADC (IC52.46)
LMS3_BB_ADC2_DA3_P: 17_FPGA_B12_B13_B14_B15 (IC35.T19), 26_LMS3_RX2_BB_ADC (IC52.47)
LMS3_BB_ADC2_DA4_N: 17_FPGA_B12_B13_B14_B15 (IC35.AA23), 26_LMS3_RX2_BB_ADC (IC52.50)
LMS3_BB_ADC2_DA4_P: 17_FPGA_B12_B13_B14_B15 (IC35.AA22), 26_LMS3_RX2_BB_ADC (IC52.51)
LMS3_BB_ADC2_DA5_N: 17_FPGA_B12_B13_B14_B15 (IC35.U26), 26_LMS3_RX2_BB_ADC (IC52.52)
LMS3_BB_ADC2_DA5_P: 17_FPGA_B12_B13_B14_B15 (IC35.U25), 26_LMS3_RX2_BB_ADC (IC52.53)
LMS3_BB_ADC2_DA6_N: 17_FPGA_B12_B13_B14_B15 (IC35.W26), 26_LMS3_RX2_BB_ADC (IC52.54)
LMS3_BB_ADC2_DA6_P: 17_FPGA_B12_B13_B14_B15 (IC35.V26), 26_LMS3_RX2_BB_ADC (IC52.55)
LMS3_BB_ADC2_DB0_N: 17_FPGA_B12_B13_B14_B15 (IC35.AC26), 26_LMS3_RX2_BB_ADC (IC52.60)
LMS3_BB_ADC2_DB0_P: 17_FPGA_B12_B13_B14_B15 (IC35.AB26), 26_LMS3_RX2_BB_ADC (IC52.61)
LMS3_BB_ADC2_DB1_N: 17_FPGA_B12_B13_B14_B15 (IC35.AB25), 26_LMS3_RX2_BB_ADC (IC52.62)
LMS3_BB_ADC2_DB1_P: 17_FPGA_B12_B13_B14_B15 (IC35.AA24), 26_LMS3_RX2_BB_ADC (IC52.63)
LMS3_BB_ADC2_DB2_N: 17_FPGA_B12_B13_B14_B15 (IC35.Y20), 26_LMS3_RX2_BB_ADC (IC52.2)
LMS3_BB_ADC2_DB2_P: 17_FPGA_B12_B13_B14_B15 (IC35.W20), 26_LMS3_RX2_BB_ADC (IC52.3)
LMS3_BB_ADC2_DB3_N: 17_FPGA_B12_B13_B14_B15 (IC35.AC24), 26_LMS3_RX2_BB_ADC (IC52.4)
LMS3_BB_ADC2_DB3_P: 17_FPGA_B12_B13_B14_B15 (IC35.AB24), 26_LMS3_RX2_BB_ADC (IC52.5)
LMS3_BB_ADC2_DB4_N: 17_FPGA_B12_B13_B14_B15 (IC35.W19), 26_LMS3_RX2_BB_ADC (IC52.6)
LMS3_BB_ADC2_DB4_P: 17_FPGA_B12_B13_B14_B15 (IC35.V19), 26_LMS3_RX2_BB_ADC (IC52.7)
LMS3_BB_ADC2_DB5_N: 17_FPGA_B12_B13_B14_B15 (IC35.AA25), 26_LMS3_RX2_BB_ADC (IC52.8)
LMS3_BB_ADC2_DB5_P: 17_FPGA_B12_B13_B14_B15 (IC35.Y25), 26_LMS3_RX2_BB_ADC (IC52.9)
LMS3_BB_ADC2_DB6_N: 17_FPGA_B12_B13_B14_B15 (IC35.Y26), 26_LMS3_RX2_BB_ADC (IC52.10)
LMS3_BB_ADC2_DB6_P: 17_FPGA_B12_B13_B14_B15 (IC35.W25), 26_LMS3_RX2_BB_ADC (IC52.11)
LMS3_RESET: 07_LMS3_Misc (IC5.E27 R60.1), 18_FPGA_B16_B33_B34_B35 (IC35.W6)
LMS3_RX1_BB_I_N: 07_LMS3_Misc (IC5.AB2), 25_LMS3_RX1_BB_ADC (R326.2 R329.2)
LMS3_RX1_BB_I_P: 07_LMS3_Misc (IC5.Y6), 25_LMS3_RX1_BB_ADC (R329.1 R332.2)
LMS3_RX1_BB_Q_N: 07_LMS3_Misc (IC5.AA5), 25_LMS3_RX1_BB_ADC (R337.2 R339.2)
LMS3_RX1_BB_Q_P: 07_LMS3_Misc (IC5.AB4), 25_LMS3_RX1_BB_ADC (R339.1 R342.2)
LMS3_RX2_BB_I_N: 07_LMS3_Misc (IC5.AC3), 26_LMS3_RX2_BB_ADC (R354.2 R357.2)
LMS3_RX2_BB_I_P: 07_LMS3_Misc (IC5.AD2), 26_LMS3_RX2_BB_ADC (R357.1 R360.2)
LMS3_RX2_BB_Q_N: 07_LMS3_Misc (IC5.AB6), 26_LMS3_RX2_BB_ADC (R365.2 R367.2)
LMS3_RX2_BB_Q_P: 07_LMS3_Misc (IC5.AC5), 26_LMS3_RX2_BB_ADC (R367.1 R370.2)
LMS3_RXEN: 07_LMS3_Misc (IC5.V34 R62.2), 18_FPGA_B16_B33_B34_B35 (IC35.U7)
LMS3_RxPLL_CLK: 07_LMS3_Misc (IC5.AM24), 29_Clocks2 (C801.2 R473.1)
LMS3_TX1_1: 10_LMS3_RF (C64.1), 15_LMS2_RF1_Misc (R141.2 R144.2)
LMS3_TX2_1: 10_LMS3_RF (C63.1), 16_LMS2_RF2_Misc (R152.2 R155.2)
LMS3_TXEN: 07_LMS3_Misc (IC5.U29 R61.2), 18_FPGA_B16_B33_B34_B35 (IC35.Y7)
LMS3_TxPLL_CLK: 07_LMS3_Misc (IC5.E5), 29_Clocks2 (C800.2 R472.1)
PCIE_PERSTn: 17_FPGA_B12_B13_B14_B15 (IC35.R23), 19_FPGA_misc (P1.A11)
PCIE_SMCLK: 17_FPGA_B12_B13_B14_B15 (IC35.R22), 19_FPGA_misc (P1.B5)
PCIE_SMDAT: 17_FPGA_B12_B13_B14_B15 (IC35.T23), 19_FPGA_misc (P1.B6)
PCIE_WAKEn: 17_FPGA_B12_B13_B14_B15 (IC35.R18), 19_FPGA_misc (R168.1 R169.1)
PD_LMS2_BB_ADC1_DRV: 17_FPGA_B12_B13_B14_B15 (IC35.W14), 23_LMS2_RX1_BB_ADC (IC47.14 IC47.20 R280.1)
PD_LMS2_BB_ADC2_DRV: 17_FPGA_B12_B13_B14_B15 (IC35.W15), 24_LMS2_RX2_BB_ADC (IC49.14 IC49.20 R308.1)
PD_LMS3_BB_ADC1_DRV: 17_FPGA_B12_B13_B14_B15 (IC35.W16), 25_LMS3_RX1_BB_ADC (IC51.14 IC51.20 R336.1)
PD_LMS3_BB_ADC2_DRV: 17_FPGA_B12_B13_B14_B15 (IC35.AD18), 26_LMS3_RX2_BB_ADC (IC53.14 IC53.20 R364.1)
PMOD_A_PIN1: 17_FPGA_B12_B13_B14_B15 (IC35.R25), 21_Peripherals (R193.1)
PMOD_A_PIN2: 17_FPGA_B12_B13_B14_B15 (IC35.P23), 21_Peripherals (R201.1)
PMOD_A_PIN3: 17_FPGA_B12_B13_B14_B15 (IC35.P21), 21_Peripherals (R203.1)
PMOD_A_PIN4: 17_FPGA_B12_B13_B14_B15 (IC35.P19), 21_Peripherals (R207.1)
PMOD_A_PIN7: 17_FPGA_B12_B13_B14_B15 (IC35.R20), 21_Peripherals (R194.2)
PMOD_A_PIN8: 17_FPGA_B12_B13_B14_B15 (IC35.R21), 21_Peripherals (R202.2)
PMOD_A_PIN9: 17_FPGA_B12_B13_B14_B15 (IC35.P15), 21_Peripherals (R204.2)
PMOD_A_PIN10: 17_FPGA_B12_B13_B14_B15 (IC35.P16), 21_Peripherals (R208.2)
PMOD_B_PIN1: 17_FPGA_B12_B13_B14_B15 (IC35.L23), 21_Peripherals (R220.1)
PMOD_B_PIN2: 17_FPGA_B12_B13_B14_B15 (IC35.M24), 21_Peripherals (R223.1)
PMOD_B_PIN3: 17_FPGA_B12_B13_B14_B15 (IC35.M22), 21_Peripherals (R226.1)
PMOD_B_PIN4: 17_FPGA_B12_B13_B14_B15 (IC35.N22), 21_Peripherals (R230.1)
PMOD_B_PIN7: 17_FPGA_B12_B13_B14_B15 (IC35.N19), 21_Peripherals (R221.2)
PMOD_B_PIN8: 17_FPGA_B12_B13_B14_B15 (IC35.P24), 21_Peripherals (R224.2)
PMOD_B_PIN9: 17_FPGA_B12_B13_B14_B15 (IC35.P25), 21_Peripherals (R227.2)
PMOD_B_PIN10: 17_FPGA_B12_B13_B14_B15 (IC35.N23), 21_Peripherals (R231.2)
PTP_CLK1_OUT: 17_FPGA_B12_B13_B14_B15 (IC35.T25), 28_Clocks1 (R414.2 R454.2)
PTP_CLK2_OUT: 17_FPGA_B12_B13_B14_B15 (IC35.R26), 27_WR_PTP (R382.2)
PTP_CLK3_OUT: 17_FPGA_B12_B13_B14_B15 (IC35.P26), 27_WR_PTP (R388.2)
RFSW1_LMS3_RX1_V1: 10_LMS3_RF (C78.1 IC11.10), 18_FPGA_B16_B33_B34_B35 (IC35.E17)
RFSW1_LMS3_RX2_V1: 10_LMS3_RF (C79.1 IC12.10), 18_FPGA_B16_B33_B34_B35 (IC35.E18)
RFSW_LMS1_RX1_V1: 08_LMS1_RF (C34.1 IC8.10), 18_FPGA_B16_B33_B34_B35 (IC35.F15)
RFSW_LMS1_RX2_V1: 08_LMS1_RF (C40.1 IC10.10), 18_FPGA_B16_B33_B34_B35 (IC35.G15)
RFSW_LMS1_TX1_V1: 08_LMS1_RF (C33.1 IC7.10), 18_FPGA_B16_B33_B34_B35 (IC35.G19)
RFSW_LMS1_TX2_V1: 08_LMS1_RF (C39.1 IC9.10), 18_FPGA_B16_B33_B34_B35 (IC35.H16)
RFSW_LMS2_RX1C_V1: 15_LMS2_RF1_Misc (C322.1 IC24.10), 18_FPGA_B16_B33_B34_B35 (IC35.H15)
RFSW_LMS2_RX1IN_V1: 15_LMS2_RF1_Misc (C325.1 IC26.10), 18_FPGA_B16_B33_B34_B35 (IC35.D19)
RFSW_LMS2_RX2C_V1: 16_LMS2_RF2_Misc (C349.1 IC32.10), 17_FPGA_B12_B13_B14_B15 (IC35.J16)
RFSW_LMS2_RX2IN_V1: 16_LMS2_RF2_Misc (C352.1 IC34.10), 17_FPGA_B12_B13_B14_B15 (IC35.M15)
RFSW_LMS2_TRX1_V1: 15_LMS2_RF1_Misc (C309.1 IC19.10), 17_FPGA_B12_B13_B14_B15 (IC35.J14)
RFSW_LMS2_TRX1T_V1: 15_LMS2_RF1_Misc (C310.1 IC20.10), 17_FPGA_B12_B13_B14_B15 (IC35.J15)
RFSW_LMS2_TRX2_V1: 16_LMS2_RF2_Misc (C337.1 IC28.10), 18_FPGA_B16_B33_B34_B35 (IC35.H17)
RFSW_LMS2_TRX2T_V1: 16_LMS2_RF2_Misc (C336.1 IC27.10), 17_FPGA_B12_B13_B14_B15 (IC35.K18)
WR_PTP_CLK0_20: 17_FPGA_B12_B13_B14_B15 (IC35.AA19), 27_WR_PTP (R406.1)
WR_PTP_CLK0_125_N: 19_FPGA_misc (C356.2), 27_WR_PTP (IC55.5)
WR_PTP_CLK0_125_P: 19_FPGA_misc (C355.2), 27_WR_PTP (IC55.6)
WR_PTP_CLK1_20: 17_FPGA_B12_B13_B14_B15 (IC35.L22), 27_WR_PTP (R408.1)
WR_PTP_CLK1_125_N: 17_FPGA_B12_B13_B14_B15 (IC35.AC21), 27_WR_PTP (IC55.2)
WR_PTP_CLK1_125_P: 17_FPGA_B12_B13_B14_B15 (IC35.AB21), 27_WR_PTP (IC55.3)
WR_PTP_CLK2_125_N: 18_FPGA_B16_B33_B34_B35 (IC35.F4), 27_WR_PTP (IC55.31)
WR_PTP_CLK2_125_P: 18_FPGA_B16_B33_B34_B35 (IC35.G4), 27_WR_PTP (IC55.32)
WR_PTP_CLK3_125_N: 18_FPGA_B16_B33_B34_B35 (IC35.C4), 27_WR_PTP (IC55.28)
WR_PTP_CLK3_125_P: 18_FPGA_B16_B33_B34_B35 (IC35.D4), 27_WR_PTP (IC55.29)
WR_PTP_SFP_LOS: 17_FPGA_B12_B13_B14_B15 (IC35.T24), 27_WR_PTP (J24.8 R387.2)
WR_PTP_SFP_MOD_DEF0: 17_FPGA_B12_B13_B14_B15 (IC35.K26), 27_WR_PTP (J24.6 R386.2)
WR_PTP_SFP_MOD_DEF1: 17_FPGA_B12_B13_B14_B15 (IC35.K25), 27_WR_PTP (J24.5 R385.2)
WR_PTP_SFP_MOD_DEF2: 17_FPGA_B12_B13_B14_B15 (IC35.N18), 27_WR_PTP (J24.4 R384.2)
WR_PTP_SFP_RATE_SEL: 17_FPGA_B12_B13_B14_B15 (IC35.M20), 27_WR_PTP (J24.7)
WR_PTP_SFP_RD_N: 19_FPGA_misc (IC35.AD12), 27_WR_PTP (J24.12)
WR_PTP_SFP_RD_P: 19_FPGA_misc (IC35.AC12), 27_WR_PTP (J24.13)
WR_PTP_SFP_TD_N: 19_FPGA_misc (IC35.AD10), 27_WR_PTP (J24.19)
WR_PTP_SFP_TD_P: 19_FPGA_misc (IC35.AC10), 27_WR_PTP (J24.18)
WR_PTP_SFP_TX_DISABLE: 17_FPGA_B12_B13_B14_B15 (IC35.R17), 27_WR_PTP (J24.3)
WR_PTP_SFP_TX_FAULT: 17_FPGA_B12_B13_B14_B15 (IC35.R16), 27_WR_PTP (J24.2 R383.2)
XO_VC_FPGA: 17_FPGA_B12_B13_B14_B15 (IC35.N26), 28_Clocks1 (R436.1)